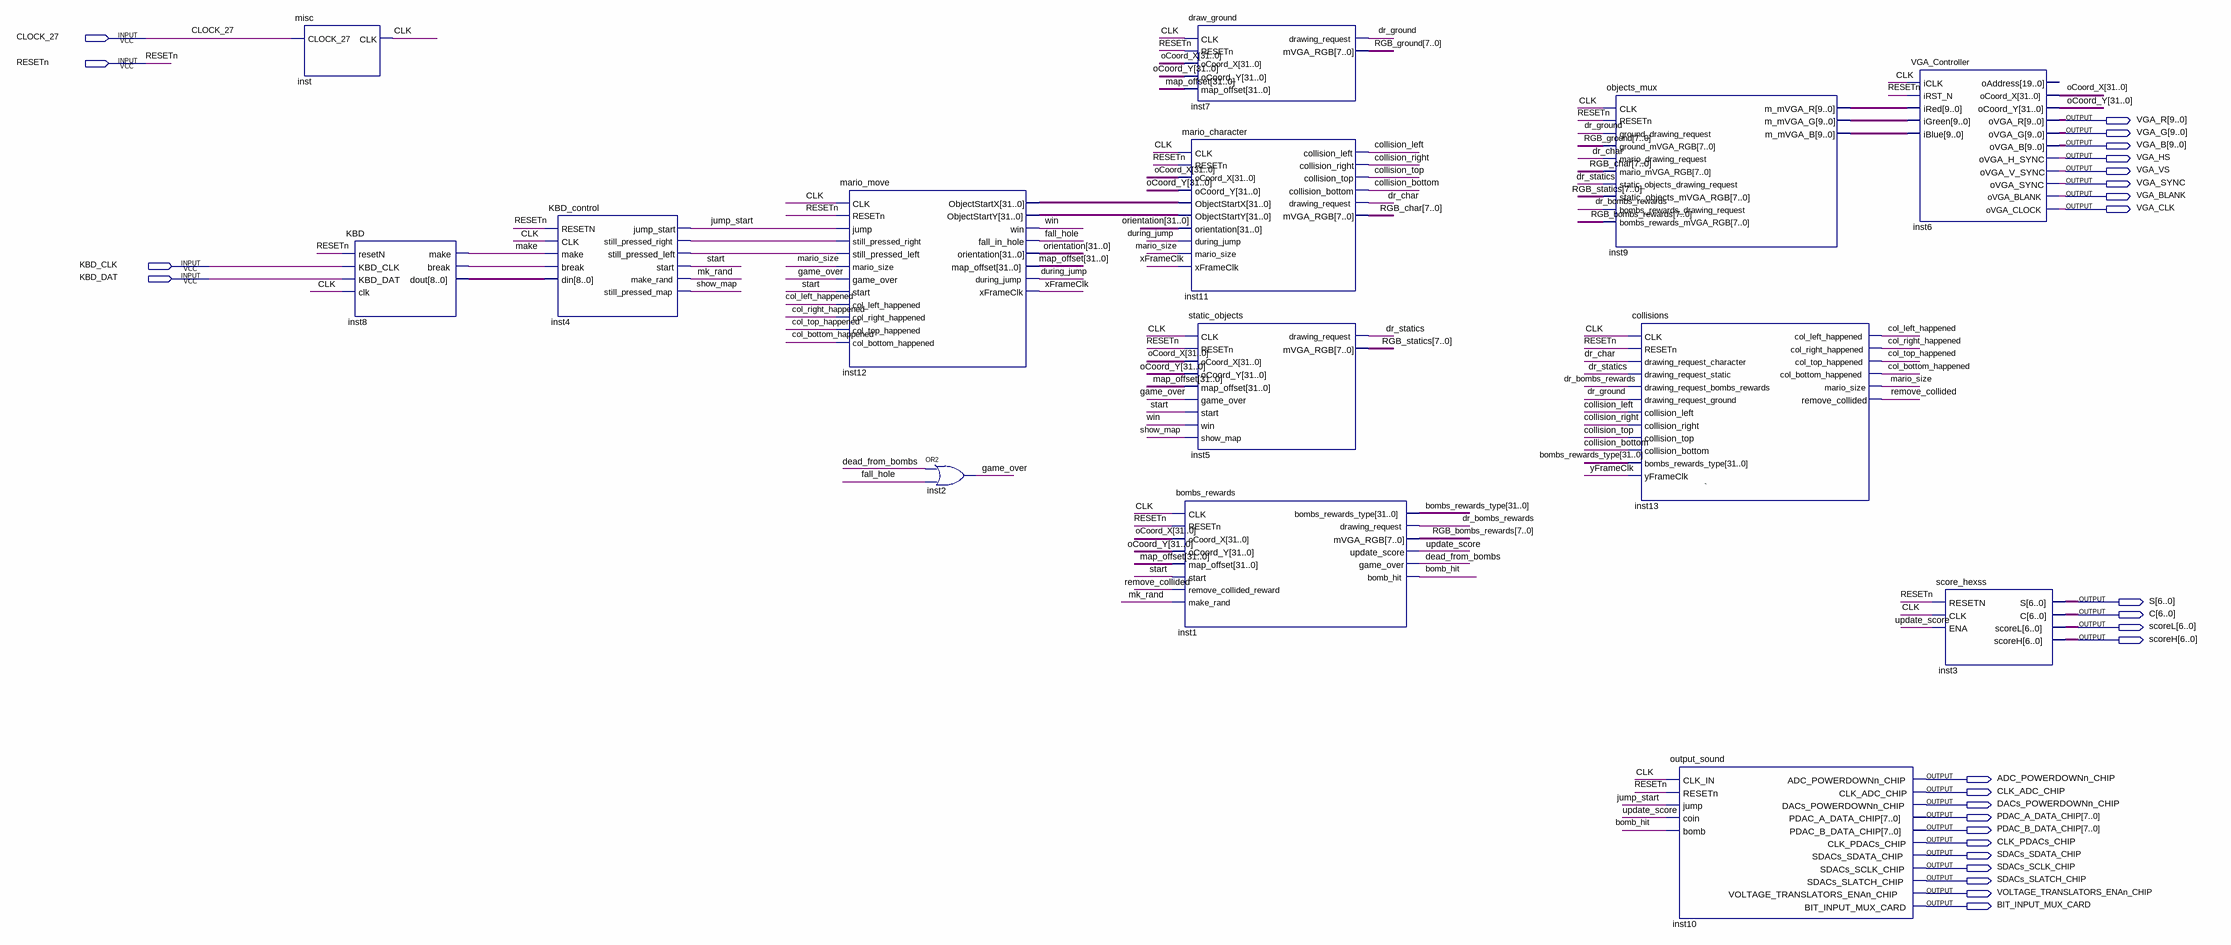
[diagram p0: schematic sheet]
// Quartus schematic TOP_Mario.bdf as structural Verilog: 14 symbols, 27 pins
module TOP_Mario (
  input  CLOCK_27,
  input  RESETn,
  input  KBD_CLK,
  input  KBD_DAT,
  output [9:0] VGA_R,
  output [9:0] VGA_G,
  output [9:0] VGA_B,
  output VGA_HS,
  output VGA_VS,
  output VGA_SYNC,
  output VGA_BLANK,
  output VGA_CLK,
  output [6:0] S,
  output [6:0] C,
  output [6:0] scoreL,
  output [6:0] scoreH,
  output ADC_POWERDOWNn_CHIP,
  output CLK_ADC_CHIP,
  output DACs_POWERDOWNn_CHIP,
  output [7:0] PDAC_A_DATA_CHIP,
  output [7:0] PDAC_B_DATA_CHIP,
  output CLK_PDACs_CHIP,
  output SDACs_SDATA_CHIP,
  output SDACs_SCLK_CHIP,
  output SDACs_SLATCH_CHIP,
  output VOLTAGE_TRANSLATORS_ENAn_CHIP,
  output BIT_INPUT_MUX_CARD
);

  wire bomb_hit, CLK, col_bottom_happened, col_left_happened, col_right_happened, col_top_happened,
       collision_bottom, collision_left, collision_right, collision_top, dead_from_bombs, dr_bombs_rewards,
       dr_char, dr_ground, dr_statics, during_jump, fall_hole, game_over, inst4_still_pressed_left,
       inst4_still_pressed_right, inst8_break, jump_start, make, mario_size, mk_rand, remove_collided,
       show_map, start, update_score, win, xFrameClk, yFrameClk;
  wire [7:0] RGB_bombs_rewards, RGB_char, RGB_ground, RGB_statics;
  wire [8:0] inst8_dout;
  wire [9:0] inst9_m_mvga_b, inst9_m_mvga_g, inst9_m_mvga_r;
  wire [31:0] bombs_rewards_type, inst12_objectstartx, inst12_objectstarty, map_offset, oCoord_X, oCoord_Y,
       orientation;

  misc inst (.CLOCK_27(CLOCK_27), .CLK(CLK));
  KBD inst8 (
    .resetN(RESETn), .KBD_CLK(KBD_CLK), .KBD_DAT(KBD_DAT), .clk(CLK), .make(make), .\break (inst8_break),
    .dout(inst8_dout));
  KBD_control inst4 (
    .RESETN(RESETn), .CLK(CLK), .make(make), .\break (inst8_break), .din(inst8_dout),
    .jump_start(jump_start), .still_pressed_right(inst4_still_pressed_right),
    .still_pressed_left(inst4_still_pressed_left), .start(start), .make_rand(mk_rand),
    .still_pressed_map(show_map));
  mario_move inst12 (
    .CLK(CLK), .RESETn(RESETn), .jump(jump_start), .still_pressed_right(inst4_still_pressed_right),
    .still_pressed_left(inst4_still_pressed_left), .mario_size(mario_size), .game_over(game_over),
    .start(start), .col_left_happened(col_left_happened), .col_right_happened(col_right_happened),
    .col_top_happened(col_top_happened), .col_bottom_happened(col_bottom_happened),
    .ObjectStartX(inst12_objectstartx), .ObjectStartY(inst12_objectstarty), .win(win),
    .fall_in_hole(fall_hole), .orientation(orientation), .map_offset(map_offset), .during_jump(during_jump),
    .xFrameClk(xFrameClk));
  or inst2 (game_over, dead_from_bombs, fall_hole);
  mario_character inst11 (
    .CLK(CLK), .RESETn(RESETn), .oCoord_X(oCoord_X), .oCoord_Y(oCoord_Y), .ObjectStartX(inst12_objectstartx),
    .ObjectStartY(inst12_objectstarty), .orientation(orientation), .during_jump(during_jump),
    .mario_size(mario_size), .xFrameClk(xFrameClk), .collision_left(collision_left),
    .collision_right(collision_right), .collision_top(collision_top), .collision_bottom(collision_bottom),
    .drawing_request(dr_char), .mVGA_RGB(RGB_char));
  bombs_rewards inst1 (
    .CLK(CLK), .RESETn(RESETn), .oCoord_X(oCoord_X), .oCoord_Y(oCoord_Y), .map_offset(map_offset),
    .start(start), .remove_collided_reward(remove_collided), .make_rand(mk_rand),
    .bombs_rewards_type(bombs_rewards_type), .drawing_request(dr_bombs_rewards),
    .mVGA_RGB(RGB_bombs_rewards), .update_score(update_score), .game_over(dead_from_bombs),
    .bomb_hit(bomb_hit));
  draw_ground inst7 (
    .CLK(CLK), .RESETn(RESETn), .oCoord_X(oCoord_X), .oCoord_Y(oCoord_Y), .map_offset(map_offset),
    .drawing_request(dr_ground), .mVGA_RGB(RGB_ground));
  static_objects inst5 (
    .CLK(CLK), .RESETn(RESETn), .oCoord_X(oCoord_X), .oCoord_Y(oCoord_Y), .map_offset(map_offset),
    .game_over(game_over), .start(start), .win(win), .show_map(show_map), .drawing_request(dr_statics),
    .mVGA_RGB(RGB_statics));
  objects_mux inst9 (
    .CLK(CLK), .RESETn(RESETn), .ground_drawing_request(dr_ground), .ground_mVGA_RGB(RGB_ground),
    .mario_drawing_request(dr_char), .mario_mVGA_RGB(RGB_char), .static_objects_drawing_request(dr_statics),
    .static_objects_mVGA_RGB(RGB_statics), .bombs_rewards_drawing_request(dr_bombs_rewards),
    .bombs_rewards_mVGA_RGB(RGB_bombs_rewards), .m_mVGA_R(inst9_m_mvga_r), .m_mVGA_G(inst9_m_mvga_g),
    .m_mVGA_B(inst9_m_mvga_b));
  collisions inst13 (
    .CLK(CLK), .RESETn(RESETn), .drawing_request_character(dr_char), .drawing_request_static(dr_statics),
    .drawing_request_bombs_rewards(dr_bombs_rewards), .drawing_request_ground(dr_ground),
    .collision_left(collision_left), .collision_right(collision_right), .collision_top(collision_top),
    .collision_bottom(collision_bottom), .bombs_rewards_type(bombs_rewards_type), .yFrameClk(yFrameClk),
    .col_left_happened(col_left_happened), .col_right_happened(col_right_happened),
    .col_top_happened(col_top_happened), .col_bottom_happened(col_bottom_happened), .mario_size(mario_size),
    .remove_collided(remove_collided));
  output_sound inst10 (
    .CLK_IN(CLK), .RESETn(RESETn), .jump(jump_start), .coin(update_score), .bomb(bomb_hit),
    .ADC_POWERDOWNn_CHIP(ADC_POWERDOWNn_CHIP), .CLK_ADC_CHIP(CLK_ADC_CHIP),
    .DACs_POWERDOWNn_CHIP(DACs_POWERDOWNn_CHIP), .PDAC_A_DATA_CHIP(PDAC_A_DATA_CHIP),
    .PDAC_B_DATA_CHIP(PDAC_B_DATA_CHIP), .CLK_PDACs_CHIP(CLK_PDACs_CHIP),
    .SDACs_SDATA_CHIP(SDACs_SDATA_CHIP), .SDACs_SCLK_CHIP(SDACs_SCLK_CHIP),
    .SDACs_SLATCH_CHIP(SDACs_SLATCH_CHIP), .VOLTAGE_TRANSLATORS_ENAn_CHIP(VOLTAGE_TRANSLATORS_ENAn_CHIP),
    .BIT_INPUT_MUX_CARD(BIT_INPUT_MUX_CARD));
  VGA_Controller inst6 (
    .iCLK(CLK), .iRST_N(RESETn), .iRed(inst9_m_mvga_r), .iGreen(inst9_m_mvga_g), .iBlue(inst9_m_mvga_b),
    .oCoord_X(oCoord_X), .oCoord_Y(oCoord_Y), .oVGA_R(VGA_R), .oVGA_G(VGA_G), .oVGA_B(VGA_B),
    .oVGA_H_SYNC(VGA_HS), .oVGA_V_SYNC(VGA_VS), .oVGA_SYNC(VGA_SYNC), .oVGA_BLANK(VGA_BLANK),
    .oVGA_CLOCK(VGA_CLK));  // open: oAddress
  score_hexss inst3 (.RESETN(RESETn), .CLK(CLK), .ENA(update_score), .S(S), .C(C), .scoreL(scoreL), .scoreH(scoreH));

  // Notes on the sheet:
  //   `
endmodule
